# Altium schematic sheet main.SchDoc
size A4; SheetNumber: 1; SheetTotal: 2
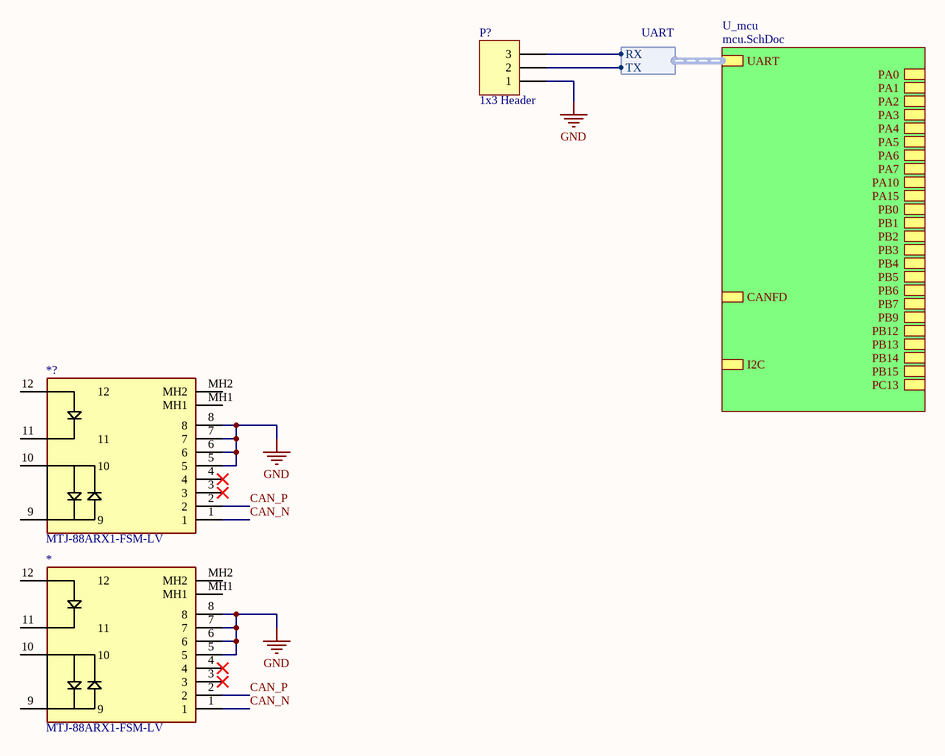
[diagram p0: main.SchDoc]

## Parts
*  MTJ-88ARX1-FSM-LV  [MTJ-88ARX1-FSM-LV]
*?  MTJ-88ARX1-FSM-LV  [MTJ-88ARX1-FSM-LV]
P?  1x3 Header  [HDR1X3]

## Sub-sheets
U_mcu = mcu.SchDoc: CANFD (harness CANFD), UART (harness UART), I2C (harness I2C), PA0, PA1, PA2, PA3, PA4, PA5, PA6, PA7, PA10, PA15, PB0, PB1, PB2, PB3, PB4, PB5, PB6, PB7, PB9, PB12, PB13, PB14, PB15, PC13

## Harnesses
UART: RX, TX

## Nets
GND: *.5 *.6 *.7 *.8 *?.5 *?.6 *?.7 *?.8 P?.1
CAN_N: *.1 *?.1
CAN_P: *.2 *?.2
NetP?_2: P?.2 ; sheet U_mcu/UART.TX
NetP?_3: P?.3 ; sheet U_mcu/UART.RX

Not connected (* = marked no-connect by the designer): * 3* 4* 9 10 11 12 MH1 MH2; *? 3* 4* 9 10 11 12 MH1 MH2

## Library data of the parts
* *? = MTJ-88ARX1-FSM-LV: RJ45 Connector
P? = 1x3 Header: 1x3 Pin Header